# EAGLE design rtc (EAGLE 6.6.0)
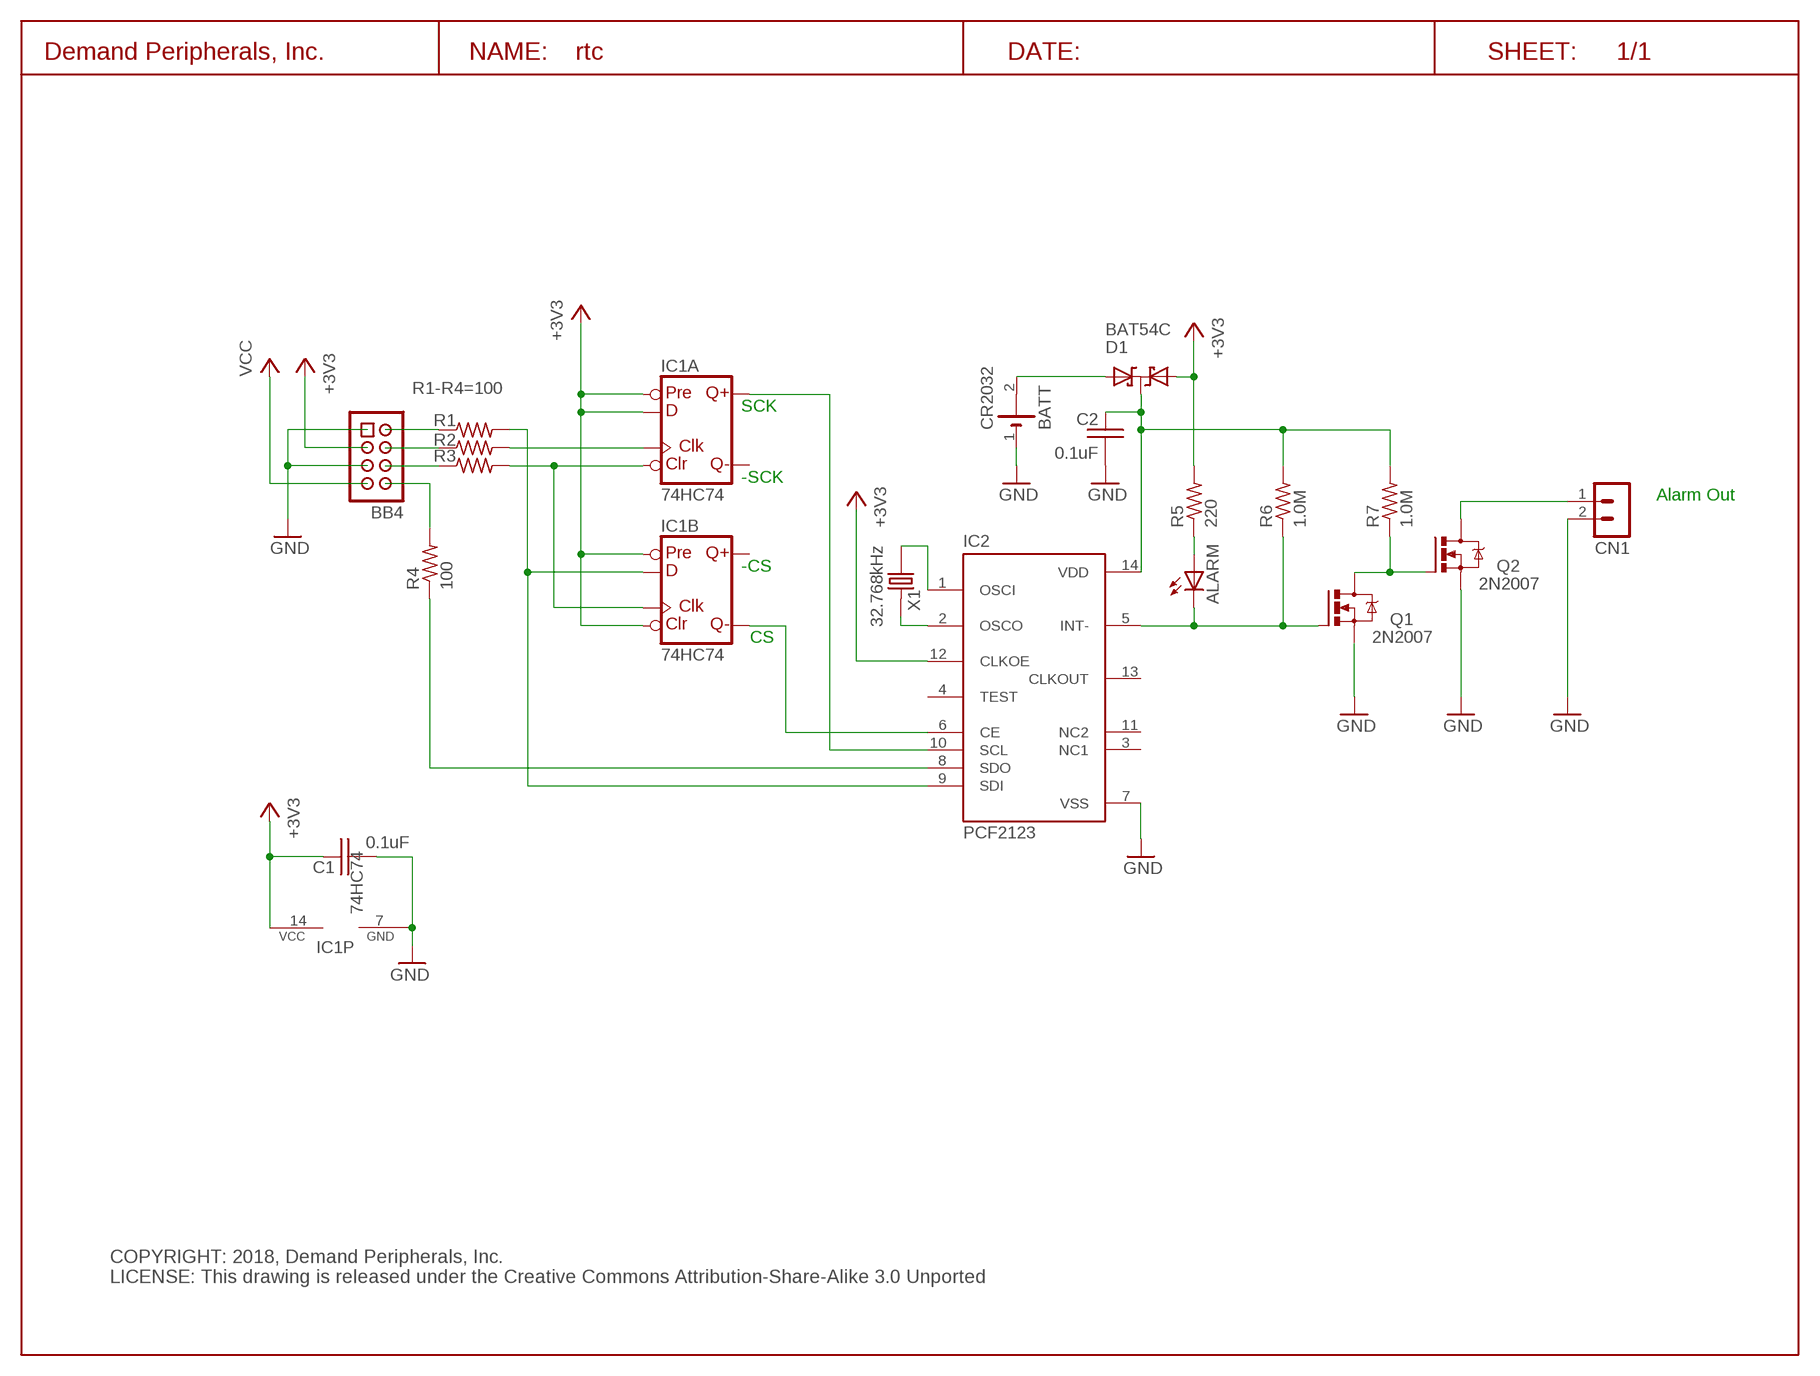
[diagram p0: schematic, sheet 1]

## Parts
ALARM  Red_LED  LED-0805-RED  [0805]
BATT  CR2032  CR2032_KEYSTONE  [CR2032_KEYSTONE]
BB4  BB_CON  HDR-4X2-SHR  [HDR-4X2]
C1  0.1uF  C0.1UF_C0603  [C0603]
C2  0.1uF  C0.1UF_C0603  [C0603]
CN1  HDR-2X1-LCK  [HDR-2X1]
D1  BAT54C  [SOT23]
IC1  74HC74  74AHC74SS  [SO14]
IC2  PCF2123  [TSSOP14]
Q1  2N2007  2N7002L  [SOT23]
Q2  2N2007  2N7002L  [SOT23]
R1  100  R100_R0603  [R0603]
R2  100  R100_R0603  [R0603]
R3  100  R100_R0603  [R0603]
R4  100  R100_R0603  [R0603]
R5  220  R220_R0603  [R0603]
R6  1.0M  R1M_R0603  [R0603]
R7  1.0M  R1M_R0603  [R0603]
U$1  DP_FRAME_L  [LETTER_L]
X1  32.768kHz  CRYSTAL-32.768  [4-SOJ]

## Nets
+3V3: BB4.3 C1.1 D1.2(A) IC1.2(A:D) IC1.4(A:PRE) IC1.10(B:PRE) IC1.13(B:CLR) IC1.14(P:VCC) IC2.12(CLKOE) R5.2
GND: BATT.1(-) BB4.1 BB4.5 C1.2 C2.2 CN1.2 IC1.7(P:GND) IC2.7(VSS) Q1.3(S) Q2.3(S)
N$1: BB4.4 R2.1
N$2: BB4.6 R3.1
N$3: IC1.3(A:CLK) R2.2
N$4: IC1.1(A:CLR) IC1.11(B:CLK) R3.2
N$5: ALARM.A R5.1
N$6: Q1.2(D) Q2.1(G) R7.1
N$7: C2.1 D1.3(CC) IC2.14(VDD) R6.2 R7.2
N$8: IC2.2(OSCO) X1.4
N$9: IC2.1(OSCI) X1.1
N$10: BATT.2(+) D1.1(A1)
N$11: BB4.2 R1.1
N$12: ALARM.C IC2.5(INT-) Q1.1(G) R6.1
N$13: IC1.12(B:D) IC2.9(SDI) R1.2
N$14: BB4.8 R4.2
N$15: CN1.1 Q2.2(D)
N$18: IC2.8(SDO) R4.1
N$19: IC1.8(B:!Q) IC2.6(CE)
N$20: IC1.5(A:Q) IC2.10(SCL)
VCC: BB4.7
Unconnected: BATT.3(+) IC1.6(A:!Q) IC1.9(B:Q) IC2.3(NC1) IC2.4(TEST) IC2.11(NC2) IC2.13(CLKOUT)

## Notes on the sheet
- R1-R4=100
- SCK
- -SCK
- Alarm Out
- -CS
- CS
- COPYRIGHT: 2018, Demand Peripherals, Inc.
  LICENSE: This drawing is released under the Creative Commons Attribution-Share-Alike 3.0 Unported

## Library data of the parts
ALARM = dpi-diopto:LED-0805-RED: Red 0805 LED, 41mcd@20ma, 160degree; VENDOR: Digikey; VENDOR-PART-NUM: 475-1415-6-ND
BATT = dpi-conn:CR2032_KEYSTONE: CR2032 Battery holder; VENDOR: Digikey; VENDOR-PART-NUM: xxxxxxxxxxxxx
BB4 = dpi-conn:HDR-4X2-SHR: Shrouded 4x2 pin header; VENDOR: Digikey; VENDOR-PART-NUM: 609-3530-ND
C1 C2 = dpi-passive:C0.1UF_: 0.1 uF Capacitor, 25V, X7R; VENDOR: Digikey; VENDOR-PART-NUM: 1276-1126-2-ND
CN1 = dpi-conn:HDR-2X1-LCK: 2x1 pin header with friction lock; VENDOR: Mouser; VENDOR-PART-NUM: 571-6404562
D1 = dpi-diopto:BAT54C: BAT54C Dual Common Cathode Schottky; VENDOR: Digikey; VENDOR-PART-NUM: DB3X313N0LCT-ND
IC1 = dpi-transic:74AHC74: Dual D type positive edge triggered FLIP FLOP, preset and clear; VENDOR: Digikey; VENDOR-PART-NUM: 568-4458-1-ND
IC2 = dpi-transic:PCF2123: Real-time clock; VENDOR: Digikey; VENDOR-PART-NUM: 568-4534-1-ND
Q1 Q2 = dpi-transic:2N7002L: 2N7002 NFET; VENDOR: Digikey; VENDOR-PART-NUM: 2N7002LT1GOSCT-ND
R1-R4 = dpi-passive:R100_: 100 Ohm resistor, 1%, 0.1 watt; VENDOR: Digikey; VENDOR-PART-NUM: 311-100HRTR-ND
R5 = dpi-passive:R220_: 220 Ohm resistor, 1%, 0.1 watt; VENDOR: Digikey; VENDOR-PART-NUM: 311-220HRTR-ND
R6 R7 = dpi-passive:R1M_: 1M Resistor, 1%, 0.1 watt; VENDOR: Digikey; VENDOR-PART-NUM: 311-1.00MHRTR-ND
U$1 = DP:DP_FRAME_L: Landscape/Letter Document Frame
X1 = dpi-passive:CRYSTAL-32.768: Diodes Inc 32.768KHz crystal; VENDOR: Digikey; VENDOR-PART-NUM: G43270021CT-ND

## Board
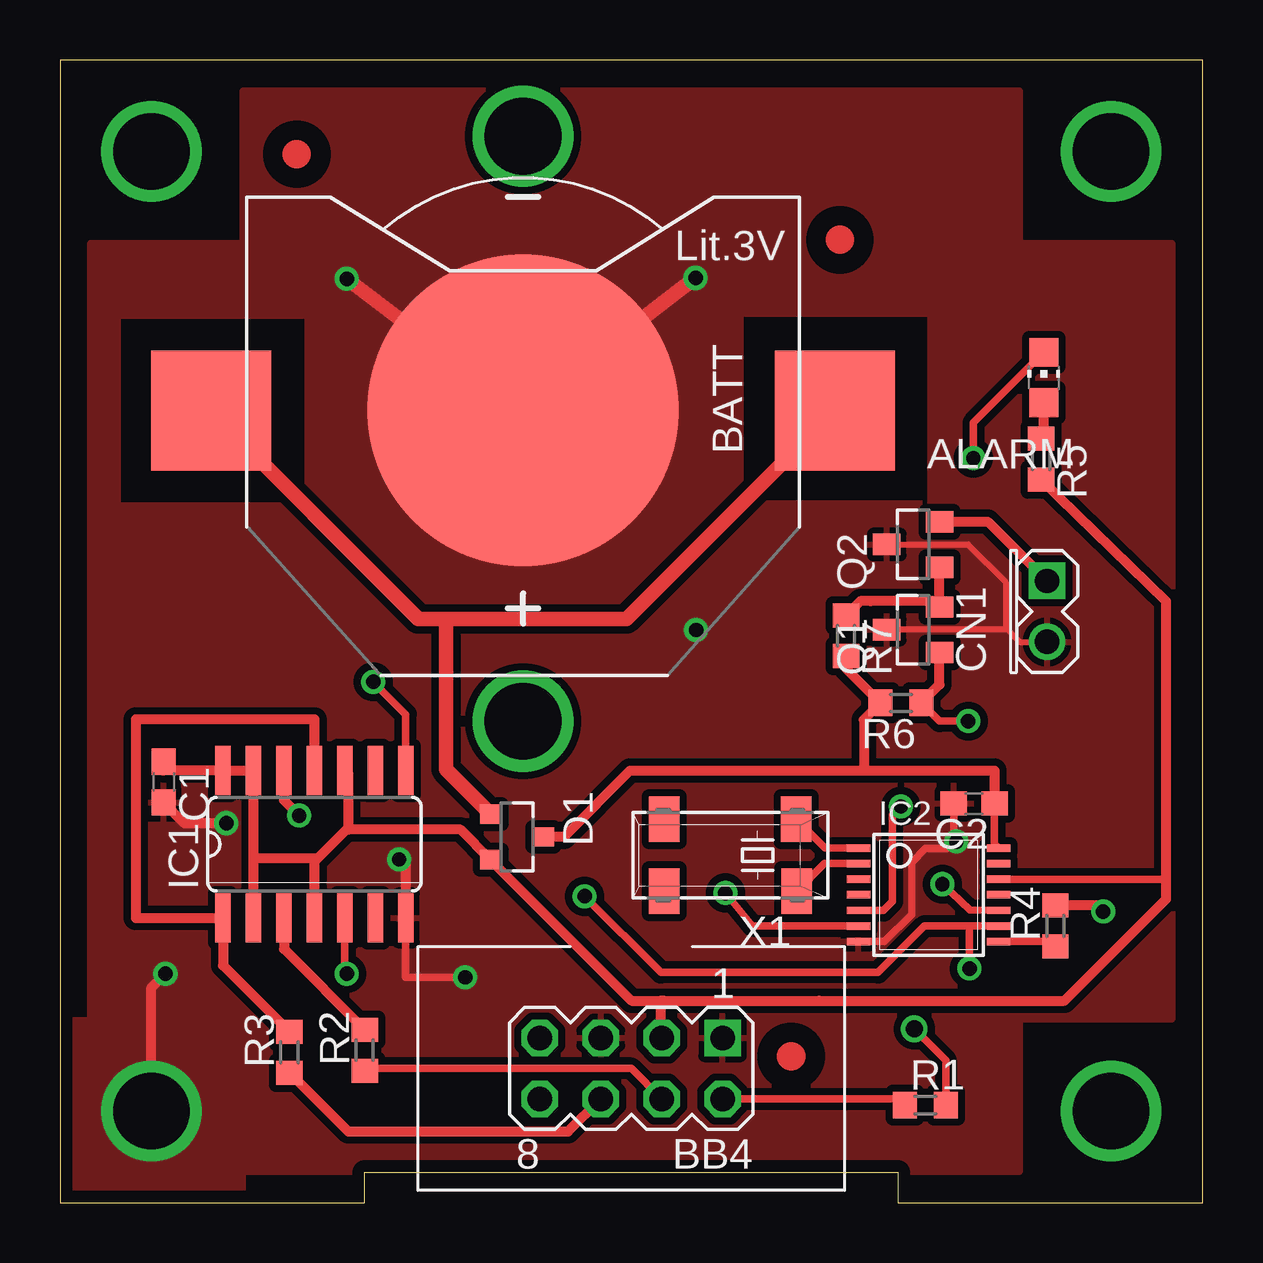
[diagram p1: board, top side]
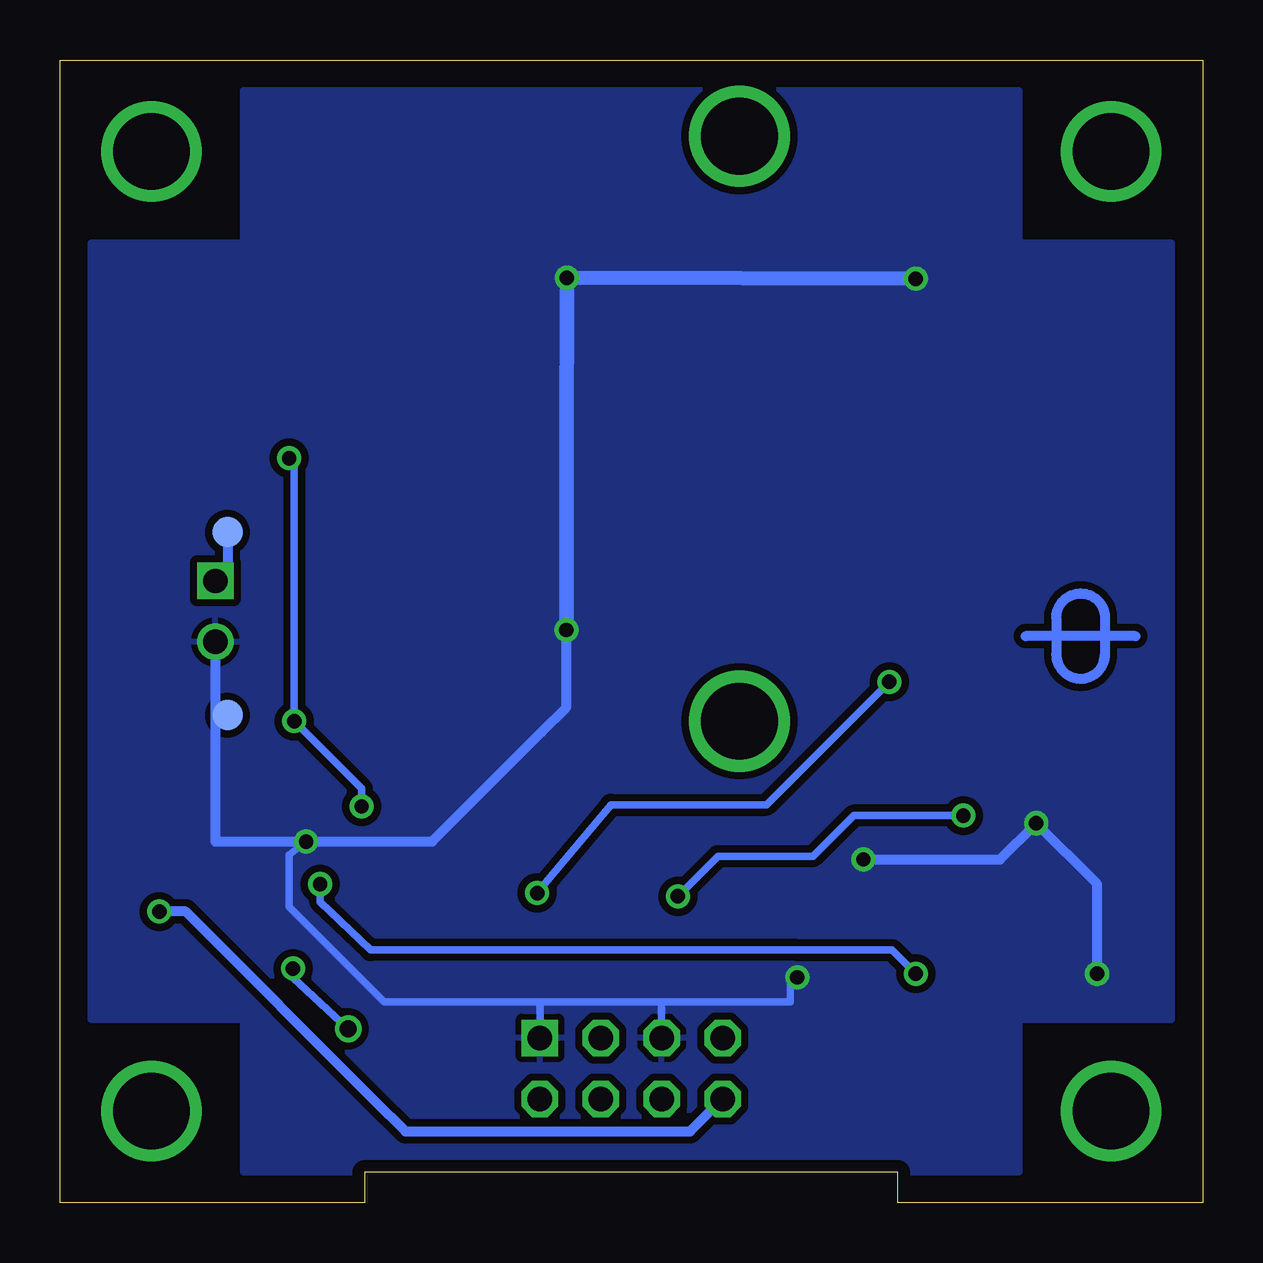
[diagram p2: board, bottom side, seen from below]

Size 47.62 x 47.62 mm. Coordinates in mm from the lower left corner, seen from the top.
Outline: 0,0 12.7,0 12.7,1.27 34.92,1.27 34.92,0 47.62,0 47.62,47.62 0,47.62 0,0
Copper layers (1*16): Top 0.035mm / dielectric 1.5mm / Bottom 0.035mm
Design rules "default *": minimum track width 10mil, minimum drill 20mil, track to track 12mil, track to pad 12mil, pad to pad 12mil, via to via 12mil, smd to smd 12mil, copper to edge 20mil, drill to drill 12mil, minimum pad ring 10mil, minimum via ring 8mil, stop-mask expansion 4mil, vias tented up to drill 50mil, thermal gap 10mil
tKeepout: area 15.1,1.6 to 32.4,10.2; area -2.5,-2.5 to -2.4,-2.5
tRestrict: area 2.6,29.2 to 10.2,36.8; area 28.5,29.3 to 36.1,36.9

### Footprints (pad centres in the part's own frame; a part is rotated, then mirrored left to right if it is on the bottom)
0805 = smd 1.2 x 1.2: A -1.05,0; C 1.05,0
CR2032_KEYSTONE = smd 13 x 13: 1 0,0 | smd 5 x 5: 2 -13,0; 3 13,0
HDR-4X2 = drill 1.016 square: 1 -3.81,-1.27 | drill 1.016 octagon: 2 -3.81,1.27; 3 -1.27,-1.27; 4 -1.27,1.27; 5 1.27,-1.27; 6 1.27,1.27; 7 3.81,-1.27; 8 3.81,1.27
C0603 = smd 1.1 x 1: 1 -0.85,0; 2 0.85,0
HDR-2X1 = drill 1.016 square: 1 1.27,0 | drill 1.016: 2 -1.27,0
SOT23 = smd 0.8 x 0.9: 1 -0.95,-1.1; 2 0.95,-1.1; 3 0,1.1
TEST-POINT = smd 1.27 x 1.27: P1 0,0
SO14 = smd 0.66 x 2.032: 1 -3.81,-3.073; 2 -2.54,-3.073; 3 -1.27,-3.073; 4 0,-3.073; 5 1.27,-3.073; 6 2.54,-3.073; 7 3.81,-3.073; 8 3.81,3.073; 9 2.54,3.073; 10 1.27,3.073; 11 0,3.073; 12 -1.27,3.073; 13 -2.54,3.073; 14 -3.81,3.073
TSSOP14 = smd 0.305 x 0.991: 1 -1.95,-2.918; 2 -1.3,-2.918; 3 -0.65,-2.918; 4 0,-2.918; 5 0.65,-2.918; 6 1.3,-2.918; 7 1.95,-2.918; 8 1.95,2.918; 9 1.3,2.918; 10 0.65,2.918; 11 0,2.918; 12 -0.65,2.918; 13 -1.3,2.918; 14 -1.95,2.918
SOT23' = smd 0.889 x 1.143: 1 -0.95,-1.1; 2 0.95,-1.1; 3 0,1.1
R0603 = smd 1 x 1.1: 1 -0.85,0; 2 0.85,0
4-SOJ = smd 1.27 x 1.88: 1 -2.75,-1.5; 2 2.75,-1.5; 3 2.75,1.5; 4 -2.775,1.5

### Placement (x,y rotation side)
ALARM  41.01,34.39 90 top
BATT  19.3,33.02 180 top
BB4  23.81,5.59 180 top
C1  4.32,17.53 270 top
C2  38.1,16.64 180 top
CN1  41.15,24.64 90 top
D1  19.05,15.24 270 top
E$1  [TEST-POINT]  40.64,27.94 0 bottom
E$2  [TEST-POINT]  40.64,20.32 0 bottom
IC1  10.6,14.94 0 top
IC2  36.21,12.83 270 top
Q1  2N2007  [SOT23']  35.56,23.88 90 top
Q2  2N2007  [SOT23']  35.56,27.43 90 top
R1  36.07,4.06 0 top
R2  12.7,6.35 90 top
R3  9.56,6.26 90 top
R4  41.49,11.53 90 top
R5  40.89,30.99 270 top
R6  35.05,20.83 180 top
R7  32.77,23.62 270 top
U$1  0,0 0 top
U$2  [DPI-1]  5.08,23.61 270 bottom
U$3  [FIDUCIAL]  9.87,43.7 0 top
U$4  [FIDUCIAL]  30.48,6.1 0 top
U$5  [FIDUCIAL]  32.51,40.13 0 top
X1  27.94,14.48 180 top

### Tracks (layer width: path | path; a pad name or v marks a point on that pad's centre or on a via)
+3V3
  Top 0.305: IC2.12 46.1,13.48 46.11,13.49
  Top 0.406: R5.2 46.11,25.06 46.11,13.49 46.11,12.65 41.87,8.41 31.65,8.41 25.17,8.41 | 25.17,8.41 25.03,8.41 25.03,6.35 BB4.3 | C1.1 4.32,18.01 IC1.14 IC1.13 8.06,14.34 | IC1.2 8.06,14.34 | 25.17,8.41 23.83,8.41 D1.2 16.7,15.54 12.01,15.54 | 12.01,15.54 11.94,15.54 10.73,14.34 | 10.73,14.34 8.06,14.34 | IC1.10 12.01,17.87 12.01,15.54 | IC1.4 10.6,14.34 10.73,14.34
GND  (via drill 0.6, 3.17)
  Top 0.254: 39.51,23.88 Q1.3 | Q2.3 37.85,27.43 39.42,25.86 39.42,23.96 39.51,23.88 | 39.51,23.88 40.02,23.37 CN1.2
  Top 0.305: C2.2 37.25,15.48 v37.36,15.05 36.99,14.76 36.08,14.76 35.51,14.19 35.51,12.01 34.37,10.88 IC2.7 | IC1.7 14.41,9.38 v16.89,9.38
  Top 0.406: v14.13,14.3 14.41,14.3 IC1.7 | v6.93,15.81 5.18,15.81 C1.2 | v3.81,3.81 3.81,8.95 v4.39,9.54
  Top 0.61: v26.49,38.54 BATT.1 | v11.95,38.51 19.25,32.96
  Bottom 0.305: 22.54,8.37 19.94,8.37 17.17,8.37 17.17,9.11 v16.89,9.38 | 22.54,8.37 BB4.5 | 27.62,8.37 BB4.1 | 22.54,8.37 27.62,8.37 | 27.62,8.37 34.11,8.37 38.08,12.33 38.08,14.29 38.08,14.49 v37.36,15.05
  Bottom 0.406: 26.53,31.28 26.5,31.25 | v14.13,14.3 8.45,14.3 v6.93,15.81 4.39,13.27 v4.39,9.54 | v26.52,23.86 26.52,20.64 27.55,19.61 32.11,15.05 v37.36,15.05 41.15,15.05 CN1.2
  Bottom 0.61: v11.95,38.51 v26.49,38.54 26.5,31.25 v26.52,23.86
  pour Top: 1.27,40.01 7.62,40.01 7.62,46.35 40.01,46.35 40.01,40.01 46.35,40.01 46.35,7.62 40.01,7.62 40.01,1.27 7.62,1.27 7.62,0.51 0.51,0.51 0.51,7.62 1.27,7.62
  pour Bottom: 1.27,40.01 7.62,40.01 7.62,46.35 40.01,46.35 40.01,40.01 46.35,40.01 46.35,7.62 40.01,7.62 40.01,1.27 7.62,1.27 7.62,7.62 1.27,7.62
MOUNT2  (via drill 3.17)
  other vias: 43.81,43.81
MOUNT3  (via drill 3.17)
  other vias: 43.81,3.81
MOUNT4  (via drill 3.17)
  other vias: 3.81,43.81
N$1
  Top 0.305: BB4.4 23.81,5.59 22.91,5.59 12.7,5.59 R2.1
N$2
  Top 0.406: R3.1 12.02,2.96 21.07,2.96 21.18,2.96 BB4.6
N$3
  Top 0.406: IC1.3 9.34,10.57 R2.2
N$4
  Top 0.305: R3.2 9.48,7.19
  Top 0.406: R3.2 6.79,9.88 IC1.1 3.16,11.86 3.16,12.62 3.16,20.14 3.54,20.14 10.6,20.14 IC1.11
N$5
  Top 0.406: R5.1 41.01,31.95 ALARM.A
N$6
  Top 0.406: Q2.1 Q1.2 36.42,25.07 33.8,25.07 33.36,25.07 R7.1
N$7
  Top 0.305: C2.1 38.95,14.95 IC2.14
  Top 0.406: C2.1 38.95,18.01 33.5,18.01 | 33.5,18.01 30.5,18.01 23.98,18.01 23.77,18.01 21,15.24 D1.3 | 33.5,18.01 33.5,20.13 R6.2 32.77,22.26 R7.2
N$8
  Top 0.305: IC2.2 31.86,14.13 X1.4
N$9
  Top 0.305: IC2.1 31.89,14.78 X1.1
N$10
  Top 0.61: BATT.2 23.62,24.33 19.28,24.33 16.09,24.33 | 16.09,24.33 14.92,24.33 6.11,33.15 14.86,24.4 | D1.1 16.09,18.05 16.09,24.33
N$11
  Top 0.305: BB4.2 35.22,4.32 R1.1
  Top 0.406: 34.96,3.81 R1.1
N$12  (via drill 0.6)
  Top 0.305: IC2.5 34.33,12.18 34.7,12.55 34.7,16.15 v35.05,16.51 | v37.86,20.07 36.66,20.07 R6.1 | ALARM.C 38.08,32.51 v38.08,31.03
  Top 0.406: R6.1 36.66,21.59 Q1.1
  Bottom 0.305: v35.05,16.51 35.05,17.26 v37.86,20.07 37.86,30.81 v38.08,31.03
N$13  (via drill 0.6, 0.7)
  Top 0.305: 37.38,11.53 36.04,11.53 34.1,9.59 25.04,9.59 v21.87,12.76 | 37.38,11.53 IC2.9 | R1.2 36.92,5.93 v35.61,7.24 | v37.91,9.75 37.9,11.54 37.38,11.53
  Top 0.406: IC1.12 9.34,16.76 v9.97,16.13
  Bottom 0.305: v35.61,7.24 37.91,9.36 v37.91,9.75 | v9.97,16.13 14.54,16.13 16.24,14.43 20.21,14.43 v21.87,12.76
N$14  (via drill 0.6)
  Top 0.406: R4.2 43.23,12.38 v43.48,12.13
  Bottom 0.406: v43.48,12.13 42.39,12.13 34.53,4.27 33.22,2.96 21.36,2.96 BB4.8
N$15
  Top 0.406: Q2.2 38.67,28.38 CN1.1
N$16
  Bottom 0.406: 40.64,27.43 40.64,26.58
N$18
  Top 0.305: IC2.8 41.29,10.88 R4.1
N$19  (via drill 0.6)
  Top 0.305: IC2.6 28.86,11.54 v27.74,12.9 | IC1.8 14.41,20.34 v13.06,21.7
  Bottom 0.305: v27.74,12.9 24.66,16.57 18.19,16.57 v13.06,21.7
N$20  (via drill 0.6)
  Top 0.305: v36.78,13.27 37.92,12.19 IC2.10 | IC1.5 11.87,9.61 v11.95,9.54
  Bottom 0.305: v36.78,13.27 36.78,12.54 34.68,10.53 16.9,10.53 12.94,10.53 v11.95,9.54
N$21  (via drill 3.2)
  other vias: 19.3,44.45
N$22  (via drill 3.2)
  other vias: 19.3,20.07

### Text on the board
tTest: 1.875 Inches | 1.575 Inches | Neg Side Down | RTC, Rev 18B | CR2032 | (C) 2018, Demand Peripherals, Inc. | LED | Alarm | R5 | + | Q2 | Q1 | R7 | Alarm | C1 | R6 | Gnd | Q1 | C2 | IC2 | 1.575 Inches | 1.875 Inches | D1 | IC1 | R4 | R3 | R2 | R1